# Altium schematic sheet ALU_AND.SchDoc
size A; Author: E. Sims; Organization: Let's Build Rockets Inc.; SheetNumber: 2; SheetTotal: 7
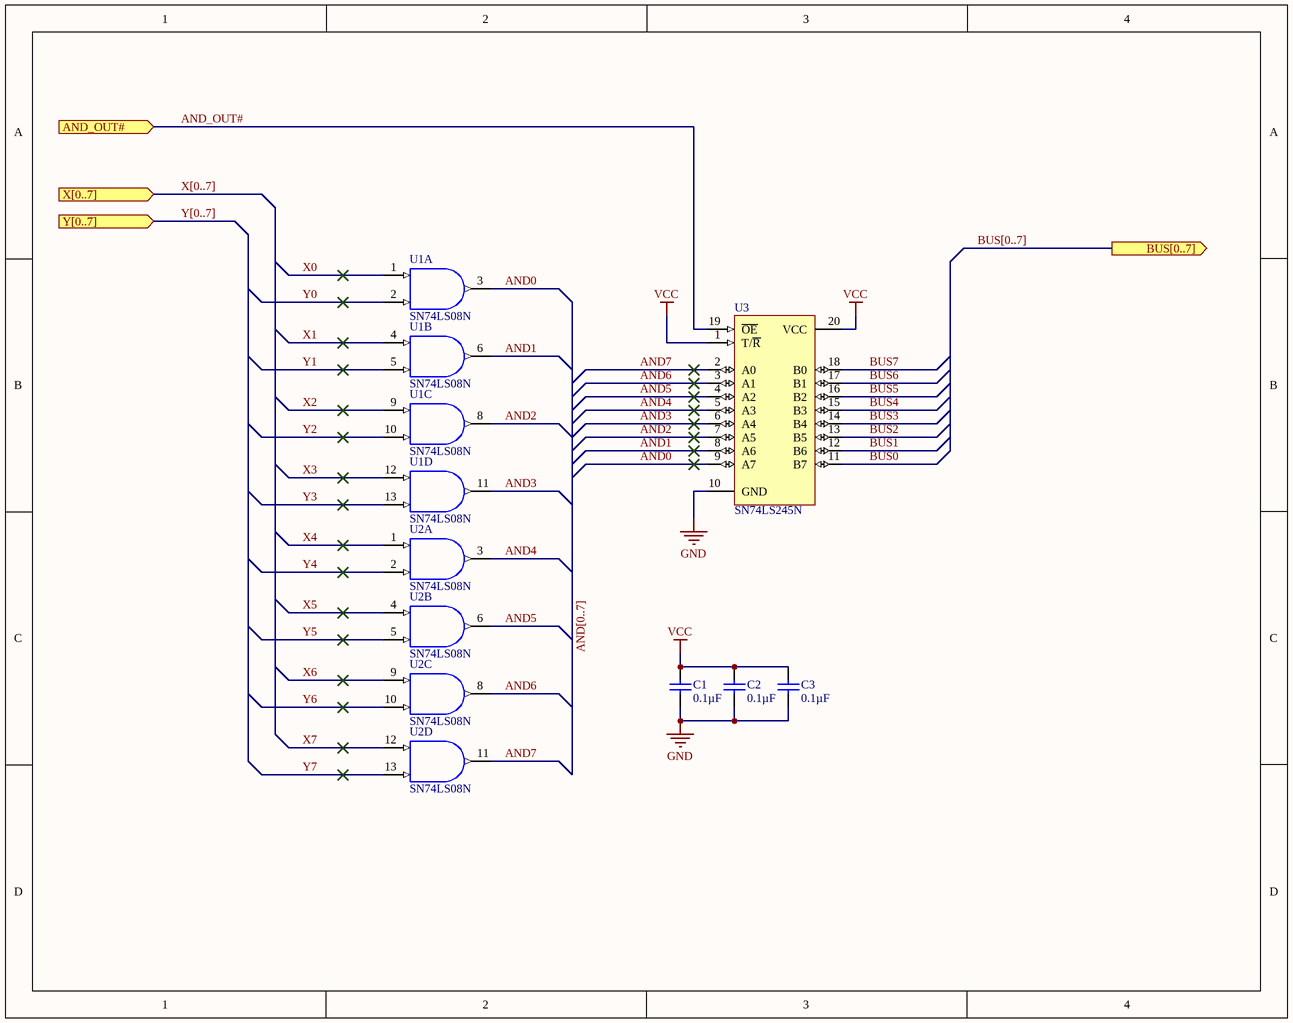
[diagram p0: ALU_AND.SchDoc]

## Parts
C1  Capacitance: 0.1µF  [VISH-K104K15X7RF5TL2]  (hidden comment: K104K15X7RF5TL2)
C2  Capacitance: 0.1µF  [VISH-K104K15X7RF5TL2]  (hidden comment: K104K15X7RF5TL2)
C3  Capacitance: 0.1µF  [VISH-K104K15X7RF5TL2]  (hidden comment: K104K15X7RF5TL2)
U1  SN74LS08N  [N014]  (parts A,B,C,D of 4)
U2  SN74LS08N  [N014]  (parts A,B,C,D of 4)
U3  SN74LS245N  [N020]

## Ports
AND_OUT# (in), BUS[0..7] (out), X[0..7] (in), Y[0..7] (in)

## Nets
GND: C1.2 C2.2 C3.2 U1.7(GND) U2.7(GND) U3.10(GND)
VCC: C1.1 C2.1 C3.1 U1.14(VCC) U2.14(VCC) U3.1(T/~{R}) U3.20(VCC)
AND0: U1.3(Y) U3.9(A7)
AND1: U1.6(Y) U3.8(A6)
AND2: U1.8(Y) U3.7(A5)
AND3: U1.11(Y) U3.6(A4)
AND4: U2.3(Y) U3.5(A3)
AND5: U2.6(Y) U3.4(A2)
AND6: U2.8(Y) U3.3(A1)
AND7: U2.11(Y) U3.2(A0)
AND_OUT#: U3.19(~{OE}) ; port AND_OUT#
BUS0: U3.11(B7)
BUS1: U3.12(B6)
BUS2: U3.13(B5)
BUS3: U3.14(B4)
BUS4: U3.15(B3)
BUS5: U3.16(B2)
BUS6: U3.17(B1)
BUS7: U3.18(B0)
X0: U1.1(A)
X1: U1.4(A)
X2: U1.9(A)
X3: U1.12(A)
X4: U2.1(A)
X5: U2.4(A)
X6: U2.9(A)
X7: U2.12(A)
Y0: U1.2(B)
Y1: U1.5(B)
Y2: U1.10(B)
Y3: U1.13(B)
Y4: U2.2(B)
Y5: U2.5(B)
Y6: U2.10(B)
Y7: U2.13(B)

## Buses and harness runs
bus AND[0..7]
bus BUS[0..7] = port BUS[0..7]
bus X[0..7] = port X[0..7]
bus Y[0..7] = port Y[0..7]

## Notes on the sheet
- Let's Build Rocket's Inc. Modular Paylaod System Based on TMP-010 Rev
  For more information visit https://github.com/LetsBuildRockets/Modular-Payload-System
  This work is licensed under CC BY-NC 4.0. To view a copy of this license, visit https://creativecommons.org/licenses/by-nc/4.0
- Title
- Size:
- Date:
- Assembly Variant:
- B
- Number:
- Time:
- Revision:
- Sheet
- of
- Author:
- File:

## Library data of the parts
C1-C3 = CMP-2000-06508-1: Ceramic Capacitor, 100 nF, +/- 10%, 50 V, -55 to 125 degC, 2-Pin THD, RoHS, Tape and Reel; Manufacturer: Vishay; Other Names: BC1084CT; Catalog Drawings: Mono-KapSide2-15_5.58Mono-KapSide1_15; Temperature Coefficient: X7R; Voltage - Rated: 50V; Online Catalog: Mono-Kap™Series; Size / Dimension: 0.157"Lx0.098"W(4.00mmx2.50mm); Operating Temperature: -55°C~125°C; Family: CeramicCapacitors; Manufacturer URL: http://www.vishay.com/; Standard Package: 1; Thickness (Max): -; Ratings: -; Datasheet Version: 08/2013; Package Description: 2-Pin Through Hole Device, Body 4 x 2.6 mm; Mounting Type: ThroughHole; Features: -; Lead Spacing: 0.098"(2.50mm); Tolerance: ±10%; Category: Capacitors; Mounting Technology: ThroughHole; Lead Style: Straight; Datasheet URL: http://www.vishay.com/docs/45171/kseries.pdf; Applications: GeneralPurpose; Package / Case: Radial; Height - Seated (Max): 0.220"(5.58mm); Package Reference: K104K15X7RF5TL2; Series: Mono-Kap™K; Packaging: CutTape(CT)
U1 U2 = SN74LS08N: Quadruple 2-Input Positive-AND Gate; Published: 8-Jun-2000; LatestRevisionDate: 04-Mar-2005; LatestRevisionNote: Stylized 3D Model Added.; DatasheetVersion: Mar-1988; PackageVersion: Oct-1995; PackageReference: N014; Publisher: Altium Limited; PackageDescription: DIP; 14 Leads; Row Spacing 7.62 mm; Pitch 2.54 mm; ComponentLink1Description: Manufacturer Link; ComponentLink1URL: http://www.ti.com/; ComponentLink2Description: Datasheet; ComponentLink2URL: http://www-s.ti.com/sc/ds/SN74LS08.pdf
U3 = SN74LS245N: Octal Bus Transceiver with 3-State Outputs; Published: 8-Jun-2000; LatestRevisionDate: 04-Mar-2005; LatestRevisionNote: Stylized 3D Model Added.; DatasheetVersion: Mar-1988; PackageVersion: Oct-1995; PackageReference: N020; Publisher: Altium Limited; PackageDescription: DIP; 20 Leads; Row Spacing 7.62 mm; Pitch 2.54 mm; ComponentLink1Description: Manufacturer Link; ComponentLink1URL: http://www.ti.com/; ComponentLink2Description: Datasheet; ComponentLink2URL: http://www-s.ti.com/sc/ds/sn74ls245.pdf